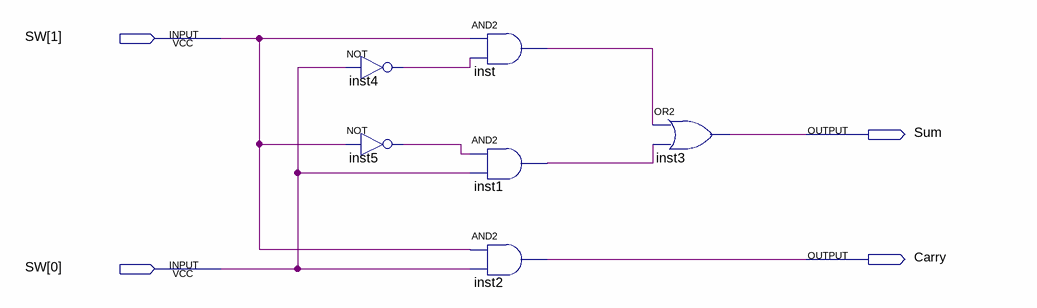
[diagram p0: schematic sheet]
// Quartus schematic half_adder.bdf as structural Verilog: 6 symbols, 4 pins
module half_adder (
  input  [1:0] SW,
  output Sum,
  output Carry
);

  wire inst1_out, inst4_out, inst5_out, inst_out;

  not inst4 (inst4_out, SW[0]);
  not inst5 (inst5_out, SW[1]);
  and inst (inst_out, SW[1], inst4_out);
  and inst1 (inst1_out, inst5_out, SW[0]);
  and inst2 (Carry, SW[1], SW[0]);
  or inst3 (Sum, inst_out, inst1_out);
endmodule
